# Altium schematic sheet Rs485_Interface.SchDoc
size A4; DrawnBy: Hanif; DocumentNumber: 6; SheetNumber: 6; SheetTotal: 8
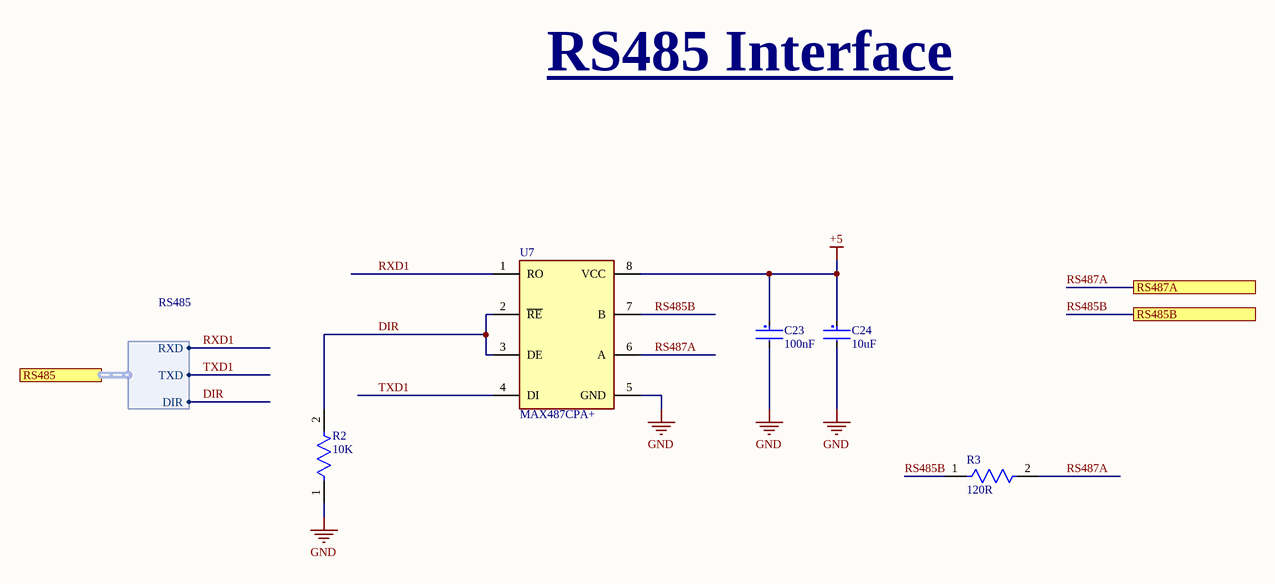
[diagram p0: Rs485_Interface.SchDoc]

## Parts
C23  100nF  [Samsung_CL31_IPC_A_1206]
C24  10uF  [Samsung_CL31_IPC_A_1206]
R2  10K  [YAGEO_RC1206-0_65_IPC_A]
R3  120R  [AXIAL 0.4]
U7  MAX487CPA+  [SOIC-8]

## Ports
RS485 (harness RS485), RS485B, RS487A

## Harnesses
RS485: RXD, TXD, DIR

## Nets
+5: C23.1 C24.1 U7.8(VCC)
GND: C23.2 C24.2 R2.1 U7.5(GND)
DIR: R2.2 U7.2(~{RE}) U7.3(DE) ; port RS485.DIR
RS485B: R3.1 U7.7(B) ; port RS485B
RS487A: R3.2 U7.6(A) ; port RS487A
RXD1: U7.1(RO) ; port RS485.RXD
TXD1: U7.4(DI) ; port RS485.TXD

## Notes on the sheet
- RS485 Interface
- Project Name:
- Size:
- Date:
- A4
- Doc Num:
- Time:
- Version:
- Sheet
- of
- File:
- Drawn by:

## Library data of the parts
C23 = CL31B104KBCNFNC: CAP CER 0.1UF 50V X7R 1206, ±10% 50V Ceramic Capacitor X7R 1206 (3216 Metric); Supplier 1: Digi-Key; Supplier Part Number 1: 1276-2744-1-ND
C24 = CL31A106KQHNNWE: CAP CER 10UF 6.3V X5R 1206, ±10% 6.3V Ceramic Capacitor X5R 1206 (3216 Metric); Supplier 1: Digi-Key; Supplier Part Number 1: 1276-3043-1-ND
R2 = RC1206FR-0710KL: 10 ±1% 0.25W, 1/4W Chip Resistor 1206 (3216 Metric) Moisture Resistant Thick Film; Supplier 1: Digi-Key; Supplier Part Number 1: 311-10.0KFRCT-ND
R3 = 120R 1/4W: RES 120 OHM 1/4W 0.1% AXIAL; Manufacturer: Yageo; Manufacturer Part Number: MFP-25BRD52-120R; Max Power Dissipation: 250mW; Temperature Coefficient: 25ppm/°C; Supplier 1: Digi-Key; RoHS: Yes; Category: Through-Hole Resistors; Stock 1: 4420; Pricing 1: 1=0.70000, 10=0.49900, 25=0.38960, 50=0.32960, 100=0.25970, 250=0.21972, 500=0.17978, 1000=0.13983 (USD); Case/Package: Axial; Min Operating Temperature: -55°C; Max Operating Temperature: 155°C; Package Quantity: 1; Resistance: 120R; Tolerance: 0.1%; Packaging: Tape and Reel; Resistor Type: Metal Film; Number of Terminations: 2; Series: MFP; Length: 0.248inch; Lead Free: Lead Free; RoHS Compliant: Yes; ComponentLink1URL: https://datasheet.ciiva.com/2713/yageolr-mfp-2013-2713048.pdf?src-supplier=Digi-Key; ComponentLink1Description: https://datasheet.ciiva.com/2713/yageolr-mfp-2013-2713048.pdf?src-supplier=Digi-Key; ComponentLink2URL: https://datasheet.ciiva.com/2713/yageolr-mfp-2013-2713049.pdf?src-supplier=Digi-Key; ComponentLink2Description: https://datasheet.ciiva.com/2713/yageolr-mfp-2013-2713049.pdf?src-supplier=Digi-Key; Supplier Part Number 1: 120ADCT-ND
U7 = MAX487ECPA+: Interface IC RS422/485 DIL-8, MAX487ECPA+, Maxim; Operating Supply Voltage: 5V; Number of Transmitters: 1; Logic Function: Transceiver; Data Rate: 256Kbps; Max Power Dissipation: 727mW; Output Voltage: 3V; Propagation Delay: 250ns; Max Supply Voltage: 5.25V; Min Supply Voltage: 4.75V; Nominal Supply Current: 250uA; Interface: RS-422,RS-485; Simplex/Duplex: Half Duplex; Supplier 1: Digi-Key; Manufacturer: Maxim; Manufacturer Part Number: MAX487ECPA+; RoHS: Yes; Category: Interface ICs; Stock 1: 285; Pricing 1: 1=4.05000, 10=3.63500, 25=3.43680, 100=3.05500 (USD); Mount: Through Hole; Case/Package: DIP; Number of Pins: 8; Min Operating Temperature: 0°C; Max Operating Temperature: 70°C; Packaging: Rail/Tube; Package Quantity: 50; Number of Receivers: 1; Number of Transceivers: 1; Series: -; Number of Drivers: 1; Supply Current: 250uA; Length: 9.91mm; Width: 7.87mm; Height: 4.45mm; Radiation Hardening: No; Lead Free: Lead Free; RoHS Compliant: Yes; REACH SVHC: No SVHC; ComponentLink1URL: https://datasheet.ciiva.com/16973/0900766b8078aed8-16973392.pdf?src-supplier=Allied+Electronics; ComponentLink1Description: https://datasheet.ciiva.com/16973/0900766b8078aed8-16973392.pdf?src-supplier=Allied+Electronics; ComponentLink2URL: https://datasheet.ciiva.com/16640/max1487e-max491e-16640614.pdf?src-supplier=Avnet+Europe; ComponentLink2Description: https://datasheet.ciiva.com/16640/max1487e-max491e-16640614.pdf?src-supplier=Avnet+Europe; ComponentLink3URL: https://datasheet.ciiva.com/8075/3976-8075401.pdf?src-supplier=Element14; ComponentLink3Description: https://datasheet.ciiva.com/8075/3976-8075401.pdf?src-supplier=Element14; ComponentLink4URL: https://datasheet.ciiva.com/14430/max1487e-max491e-14430329.pdf?src-supplier=Avnet; ComponentLink4Description: https://datasheet.ciiva.com/14430/max1487e-max491e-14430329.pdf?src-supplier=Avnet; ComponentLink5URL: https://datasheet.ciiva.com/14152/jxmax481e-491e-e-14152719.pdf?src-supplier=Distrelec; ComponentLink5Description: https://datasheet.ciiva.com/14152/jxmax481e-491e-e-14152719.pdf?src-supplier=Distrelec; ComponentLink6URL: https://datasheet.ciiva.com/1713/max1487e-max491e-1713146.pdf?src-supplier=Digi-Key; ComponentLink6Description: https://datasheet.ciiva.com/1713/max1487e-max491e-1713146.pdf?src-supplier=Digi-Key; ComponentLink7URL: https://datasheet.ciiva.com/4785/max1487e-max491e-4785914.pdf?src-supplier=Mouser; ComponentLink7Description: https://datasheet.ciiva.com/4785/max1487e-max491e-4785914.pdf?src-supplier=Mouser; Supplier Part Number 1: MAX487ECPA+-ND